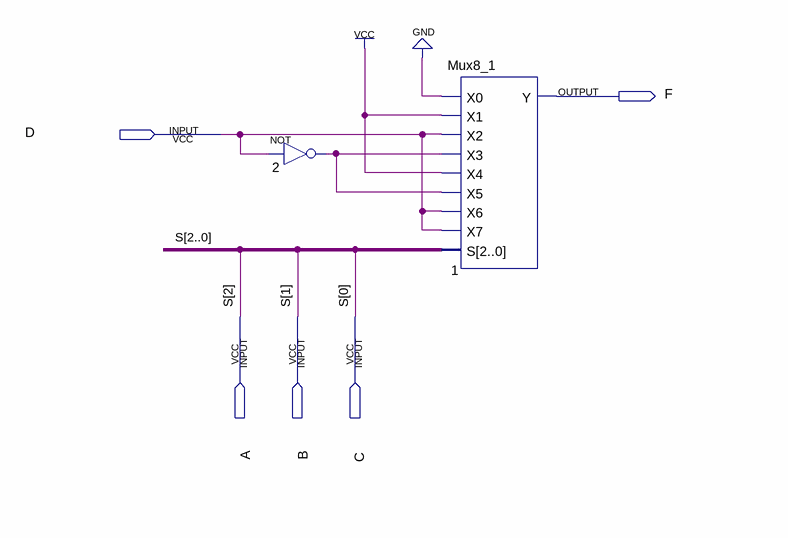
[diagram p0: schematic sheet]
// Quartus schematic Function.bdf as structural Verilog: 2 symbols, 5 pins
module Function (
  input  D,
  input  A,
  input  B,
  input  C,
  output F
);

  wire n2_out;

  not u_2 (n2_out, D);
  Mux8_1 u_1 (.X0(1'b0), .X1(1'b1), .X2(D), .X3(n2_out), .X4(1'b1), .X5(n2_out), .X6(D), .X7(D), .S({A, B, C}), .Y(F));

  // Other names for the same wires on the sheet: S[2:0] = {A, B, C}
endmodule
